# EAGLE design SparkFun_QwiicBus_Endpoint (EAGLE 9.6.0)
ABBREV: hb1; PROJECT: Heading Board
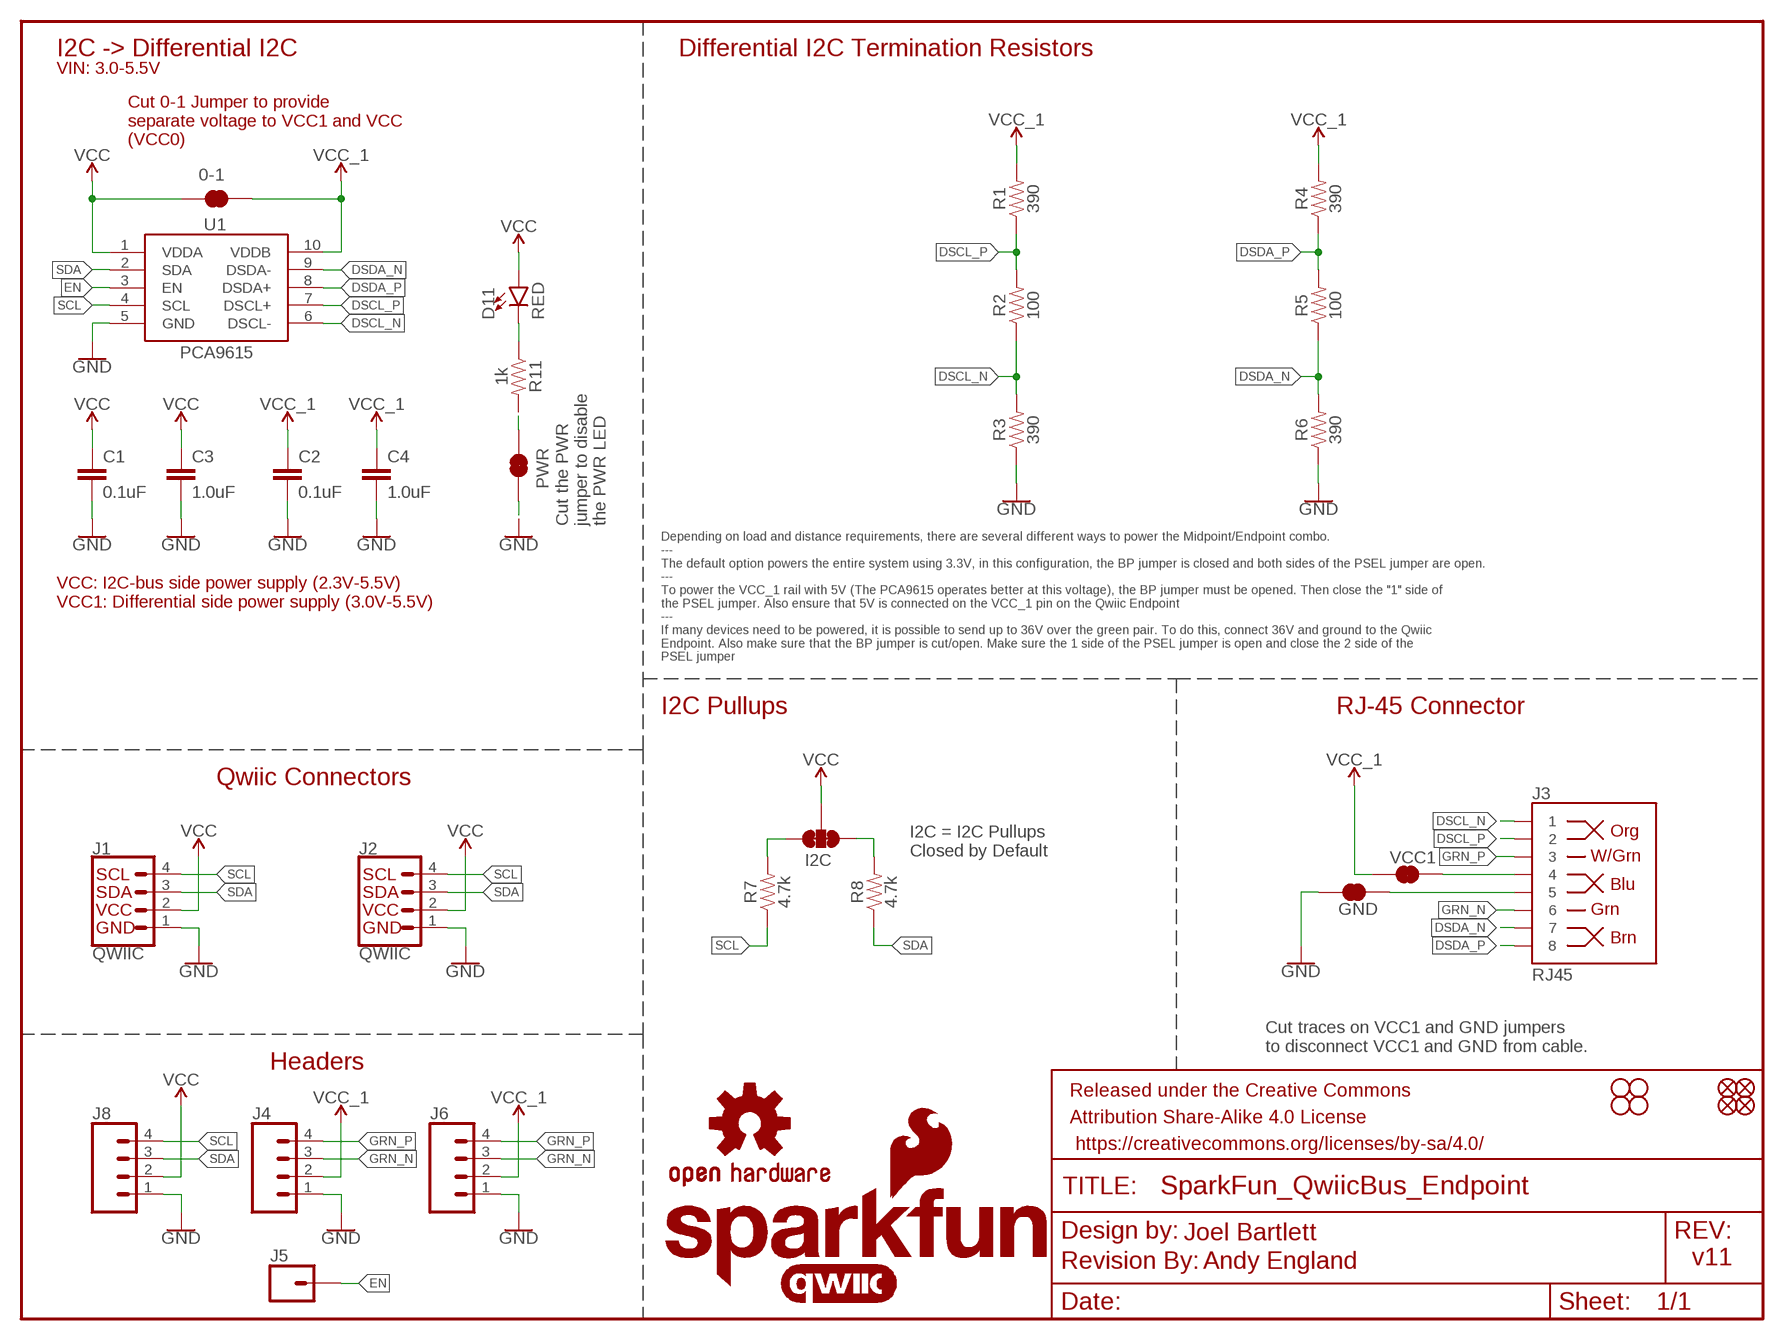
[diagram p0: schematic, sheet 1]

## Parts
0-1  JUMPER-SMT_2_NC_TRACE_SILK  [SMT-JUMPER_2_NC_TRACE_SILK]
C1  0.1uF  0.1UF-0603-25V-(+80/-20%)  [0603]
C2  0.1uF  0.1UF-0603-25V-(+80/-20%)  [0603]
C3  1.0uF  1.0UF-0603-16V-10%  [0603]
C4  1.0uF  1.0UF-0603-16V-10%  [0603]
D11  RED  LED-RED0603  [LED-0603]
FD1  FIDUCIALUFIDUCIAL  [FIDUCIAL-MICRO]
FD2  FIDUCIALUFIDUCIAL  [FIDUCIAL-MICRO]
FD3  FIDUCIALUFIDUCIAL  [FIDUCIAL-MICRO]
FD4  FIDUCIALUFIDUCIAL  [FIDUCIAL-MICRO]
FRAME1  FRAME-LETTER  [CREATIVE_COMMONS]
GND  JUMPER-SMT_2_NC_TRACE_SILK  [SMT-JUMPER_2_NC_TRACE_SILK]
H1  STAND-OFF  [STAND-OFF]
H2  STAND-OFF  [STAND-OFF]
H3  STAND-OFF  [STAND-OFF]
H4  STAND-OFF  [STAND-OFF]
I2C  JUMPER-SMT_3_2-NC_TRACE_SILK  [SMT-JUMPER_3_2-NC_TRACE_SILK]
J1  QWIIC  QWIIC_CONNECTORJS-1MM  [JST04_1MM_RA]
J2  QWIIC  QWIIC_CONNECTORJS-1MM  [JST04_1MM_RA]
J3  RJ45  RJ45-8  [RJ45-8]
J4  CONN_041X04_NO_SILK  [1X04_NO_SILK]
J5  CONN_01PTH_NO_SILK_YES_STOP  [1X01_NO_SILK]
J6  CONN_041X04_NO_SILK  [1X04_NO_SILK]
J8  CONN_041X04_NO_SILK  [1X04_NO_SILK]
LOGO1  OSHW-LOGOM  [OSHW-LOGO-M]
LOGO2  REVISION  [REVISION]
LOGO3  QWIIC_LOGO_4MM  [QWIIC_4MM]
LOGO4  SFE_LOGO_NAME_FLAME.1_INCH  [SFE_LOGO_NAME_FLAME_.1]
LOGO5  SFE_LOGO_FLAME.1_INCH  [SFE_LOGO_FLAME_.1]
PWR  JUMPER-SMT_2_NC_TRACE_SILK  [SMT-JUMPER_2_NC_TRACE_SILK]
R1  390  390OHM-0603-1/10W-1%  [0603]
R2  100  100OHM-0603-1/10W-1%  [0603]
R3  390  390OHM-0603-1/10W-1%  [0603]
R4  390  390OHM-0603-1/10W-1%  [0603]
R5  100  100OHM-0603-1/10W-1%  [0603]
R6  390  390OHM-0603-1/10W-1%  [0603]
R7  4.7k  4.7KOHM-0603-1/10W-1%  [0603]
R8  4.7k  4.7KOHM-0603-1/10W-1%  [0603]
R11  1k  1KOHM-0603-1/10W-1%  [0603]
U1  PCA9615  [TSSOP10]
VCC1  JUMPER-SMT_2_NC_TRACE_SILK  [SMT-JUMPER_2_NC_TRACE_SILK]

## Nets
DSCL_N: J3.1 R2.1 R3.2 U1.6(DSCL-)
DSCL_P: J3.2 R1.1 R2.2 U1.7(DSCL+)
DSDA_N: J3.7 R5.1 R6.2 U1.9(DSDA-)
DSDA_P: J3.8 R4.1 R5.2 U1.8(DSDA+)
EN: J5.1 U1.3(EN)
GND: C1.2 C2.2 C3.2 C4.2 GND.1 J1.1 J2.1 J4.1 J6.1 J8.1 PWR.1 R3.1 R6.1 U1.5(GND)
GRN_N: J3.6 J4.3 J6.3
GRN_P: J3.3 J4.4 J6.4
N$1: J3.4 VCC1.2
N$2: GND.2 J3.5
N$3: I2C.1 R8.2
N$4: I2C.3 R7.2
N$13: D11.C R11.1
N$14: PWR.2 R11.2
SCL: J1.4 J2.4 J8.4 R7.1 U1.4(SCL)
SDA: J1.3 J2.3 J8.3 R8.1 U1.2(SDA)
VCC: 0-1.2 C1.1 C3.1 D11.A I2C.2 J1.2 J2.2 J8.2 U1.1(VDDA)
VCC_1: 0-1.1 C2.1 C4.1 J4.2 J6.2 R1.2 R4.2 U1.10(VDDB) VCC1.1

## Notes on the sheet
- I2C -> Differential I2C | Differential I2C Termination Resistors
- VIN: 3.0-5.5V
- Cut 0-1 Jumper to provide
  separate voltage to VCC1 and VCC
  (VCC0)
- Cut the PWR 
  jumper to disable
  the PWR LED
- VCC: I2C-bus side power supply (2.3V-5.5V)
  VCC1: Differential side power supply (3.0V-5.5V)
- Depending on load and distance requirements, there are several different ways to power the Midpoint/Endpoint combo. 
  ---
  The default option powers the entire system using 3.3V, in this configuration, the BP jumper is closed and both sides of the PSEL jumper are open.
  ---
  To power the VCC_1 rail with 5V (The PCA9615 operates better at this voltage), the BP jumper must be opened. Then close the "1" side of 
  the PSEL jumper. Also ensure that 5V is connected on the VCC_1 pin on the Qwiic Endpoint
  ---
  If many devices need to be powered, it is possible to send up to 36V over the green pair. To do this, connect 36V and ground to the Qwiic 
  Endpoint. Also make sure that the BP jumper is cut/open. Make sure the 1 side of the PSEL jumper is open and close the 2 side of the
  PSEL jumper
- I2C Pullups | RJ-45 Connector
- Qwiic Connectors
- I2C = I2C Pullups
  Closed by Default
- Cut traces on VCC1 and GND jumpers 
  to disconnect VCC1 and GND from cable.
- Headers
- Joel Bartlett
- Andy England | v11

## Library data of the parts
0-1 GND PWR VCC1 = SparkFun-Jumpers:JUMPER-SMT_2_NC_TRACE: Normally closed trace jumper This jumper has a trace between two pads so it's normally closed (NC). Use a razor knife to open the connection. For best results follow the IPC guidelines for cutting traces: Cutout at least 0.063 mm (0.005 in). Remove all loose material to clean up the cut area. Seal the cut with an approved epoxy. Reapply solder to reclose the connection.
C1 C2 = SparkFun-Capacitors:0.1UF: 0.1µF ceramic capacitors A capacitor is a passive two-terminal electrical component used to store electrical energy temporarily in an electric field.; PROD_ID: CAP-00810
C3 C4 = SparkFun-Capacitors:1.0UF: 1µF ceramic capacitors A capacitor is a passive two-terminal electrical component used to store electrical energy temporarily in an electric field.; PROD_ID: CAP-00868
D11 = SparkFun-LED:LED-RED: Red SMD LED Used in manufacturing of most products at SparkFun Packages: 0603 - SMD 0603 package [Product Link] <http://docs.avagotech.com/docs/AV02-0551EN> 0603 SMART - SMD 0603 SMART package ( more efficient and expensive)[Product Link] <http://www.osram-os.com/Graphics/XPic2/00077099_0.pdf> 1206 - SMD1206 package [Product Link] <https://www.sparkfun.com/datasheets/DevTools/LilyPad/Q150OVS4.pdff> SparkFun Products: Pro Mini 328 -5V <https://www.sparkfun.com/products/821> RedBoard <https://www.sparkfun.com/products/12757> IOIO-OTG <https://www.sparkfun.com/products/13613>; PROD_ID: DIO-00819
FD1-FD4 = SparkFun-Aesthetics:FIDUCIAL: Fiducial Alignment Points Point-of-reference for pick-and-place machines and other optical instruments.
FRAME1 = SparkFun-Aesthetics:FRAME-LETTER: Schematic Frame - Letter Standard 8.5x11 US Letter frame
H1-H4 = SparkFun-Hardware:STAND-OFF: Stand Off Drill holes for mechanically mounting via screws, standoffs, etc. Note: Use the keepout ring to avoid running the screw head into surrounding components. Variant Overviews STAND-OFF - Mechanical footprint for a #4 phillips button head screw. STAND-OFF-TIGHT - Mechanical footprint for a #4 phillips button head screw, Example SparkFun Products Screw - Phillips Head (1/4", 4-40, 10 pack) <https://www.sparkfun.com/products/10453> (PRT-10453) Screw - Phillips Head (1/2", 4-40, 10 pack) <https://www.sparkfun.com/products/10452> (PRT-10452) Screw - Phillips Head (3/4", 4-40, 10 pack) <https://www.sparkfun.com/products/10451> (PRT-10451) Screw - Phillips Head (1", 4-40, 10 pack) <https://www.sparkfun.com/products/10450> (PRT-10450)
I2C = SparkFun-Jumpers:JUMPER-SMT_3_2-NC_TRACE: Normally closed trace jumper (2 of 2 connections) This jumper has a trace between all three pads so they are normally closed (NC). Use a razor knife to open the connection(s). For best results follow the IPC guidelines for cutting traces: Cutout at least 0.063 mm (0.005 in). Remove all loose material to clean up the cut area. Seal the cut with an approved epoxy. Reapply solder to reclose the connection(s).
J1 J2 = SparkFun-Connectors:QWIIC_CONNECTOR: SparkFun I2C Standard Qwiic Connector An SMD 1mm pitch JST connector makes it easy and quick (get it? Qwiic?) to connect I2C devices to each other. The Qwiic system <http://www.sparkfun.com/qwiic> enables fast and solderless connection between popular platforms and various sensors and actuators. We carry 200mm <https://www.sparkfun.com/products/14204>, 100mm <https://www.sparkfun.com/products/14205>, 50mm <https://www.sparkfun.com/products/14206>, and breadboard friendly <https://www.sparkfun.com/products/14207> Qwiic cables. We also offer 10 pcs strips <https://www.sparkfun.com/products/14323> the SMD connectors.; PROD_ID: CONN-13694; VALUE: QWIIC_RIGHT_ANGLE
J3 = SparkFun-Connectors:RJ45-8: RJ45 Jack - 8 pin Simple RJ45, 8-pin connection. Commonly used for Cat5, Cat5e, and Cat6 Ethernet cables. Here is the connector we sell at SparkFun: RJ45 8-Pin Connector <https://www.sparkfun.com/products/643> (PRT-00643) Datasheet <https://cdn.sparkfun.com/datasheets/Prototyping/04908.pdf> It is used on this SparkFun product: SparkFun RJ45 Breakout <https://www.sparkfun.com/products/716> (BOB-00716) Note, you may also be interested in the "MAGJACK" version of this. It is basically a RJ45 connector, but also has some status LEDs built into the connector housing. You can check that out in this library at the device named "MAGJACK.dev" and see these products online: RJ45 Ethernet MagJack-Compatible <https://www.sparkfun.com/products/8534> (PRT-08534) SparkFun RJ45 MagJack Breakout <https://www.sparkfun.com/products/13021> (BOB-13021); PROD_ID: CONN-08506; SF_ID: PRT-00643
J4 J6 J8 = SparkFun-Connectors:CONN_04: Multi connection point. Often used as Generic Header-pin footprint for 0.1 inch spaced/style header connections On any of the 0.1 inch spaced packages, you can populate with these: Break Away Headers - Straight <https://www.sparkfun.com/products/116> (PRT-00116) Break Away Male Headers - Right Angle <https://www.sparkfun.com/products/553> (PRT-00553) Female Headers <https://www.sparkfun.com/products/115> (PRT-00115) Break Away Headers - Machine Pin <https://www.sparkfun.com/products/117> (PRT-00117) Break Away Female Headers - Swiss Machine Pin <https://www.sparkfun.com/products/743> (PRT-00743) For SCREWTERMINALS and SPRING TERMINALS visit here: Screw Terimnals on SparkFun.com <https://www.sparkfun.com/search/results?term=Screw+Terminals> (5mm/3.5mm/2.54mm spacing) This device is also useful as a general connection point to wire up your design to another part of your project. Our various solder wires solder well into these plated through hole pads. Hook-Up Wire - Assortment (Stranded, 22 AWG) <https://www.sparkfun.com/products/11375> (PRT-11375) Hook-Up Wire - Assortment (Solid Core, 22 AWG) <https://www.sparkfun.com/products/11367> (PRT-11367) View the entire wire category on our website here <https://www.sparkfun.com/categories/141> Special notes: Molex polarized connector foot print use with SKU : PRT-08231 with associated crimp pins and housings. 1MM SMD Version SKU: PRT-10208; PROD_ID: CONN-09696
J5 = SparkFun-Connectors:CONN_01: Single connection point. Often used as Generic Header-pin footprint for 0.1 inch spaced/style header connections On any of the 0.1 inch spaced packages, you can populate with these: Break Away Headers - Straight <https://www.sparkfun.com/products/116> (PRT-00116) Break Away Male Headers - Right Angle <https://www.sparkfun.com/products/553> (PRT-00553) Female Headers <https://www.sparkfun.com/products/115> (PRT-00115) Break Away Headers - Machine Pin <https://www.sparkfun.com/products/117> (PRT-00117) Break Away Female Headers - Swiss Machine Pin <https://www.sparkfun.com/products/743> (PRT-00743) This device is also useful as a general connection point to wire up your design to another part of your project. Our various solder wires solder well into these plated through hole pads. Hook-Up Wire - Assortment (Stranded, 22 AWG) <https://www.sparkfun.com/products/11375> (PRT-11375) Hook-Up Wire - Assortment (Solid Core, 22 AWG) <https://www.sparkfun.com/products/11367> (PRT-11367) View the entire wire category on our website here <https://www.sparkfun.com/categories/141> Special notes: SMTSO-256-ET is a "flush mount" nut for a 4-40 screw. We mostly use this on specialty testbeds; it is a nice way to connect hardware to your PCB at an adjustable hieght. Also note, the SNAP packages are for using a snappable style connector. We sell a baggie of snaps and they are also used on two LilyPad designs: Snap Assortment - 30 pack (male and female) <https://www.sparkfun.com/products/11347> (DEV-11347) LilyPad Arduino SimpleSnap <https://www.sparkfun.com/products/10941> (DEV-10941) LilyPad SimpleSnap Protoboard <https://www.sparkfun.com/products/10940> (DEV-10940)
LOGO1 = SparkFun-Aesthetics:OSHW-LOGO: Open-Source Hardware (OSHW) Logo This logo indicates the piece of hardware it is found on incorporates a OSHW license and/or adheres to the definition of open source hardware found here: http://freedomdefined.org/OSHW
LOGO2 = SparkFun-Aesthetics:REVISION: "Revision By" Text Preceding text for revisor documentation. Includes schematic text on "symbols" layer, and board text on tDoc.
LOGO3 = SparkFun-Aesthetics:QWIIC_LOGO: Qwiic Logos for placement on schematic and PCB. The 5.5mm silk logo is best for placing next to Qwiic connector.
LOGO4 = SparkFun-Aesthetics:SFE_LOGO_NAME_FLAME: SparkFun Font Logo w/ Flame This is the SparkFun full logo. The logo on the schematic will always be the same size; the package variant is the height of the flame part of the logo. Default layer for the logo on the board is tSilk.
LOGO5 = SparkFun-Aesthetics:SFE_LOGO_FLAME: SparkFun Flame Logo This is the SparkFun flame logo. The logo on the schematic will always be the same size; the package variant is the height of the flame. Default layer for the logo on the board is tSilk.
R1 R3 R4 R6 = SparkFun-Resistors:390OHM: 390Ω resistor A resistor is a passive two-terminal electrical component that implements electrical resistance as a circuit element. Resistors act to reduce current flow, and, at the same time, act to lower voltage levels within circuits. - Wikipedia; PROD_ID: RES-07864
R2 R5 = SparkFun-Resistors:100OHM: 100Ω resistor A resistor is a passive two-terminal electrical component that implements electrical resistance as a circuit element. Resistors act to reduce current flow, and, at the same time, act to lower voltage levels within circuits. - Wikipedia; PROD_ID: RES-07863
R7 R8 = SparkFun-Resistors:4.7KOHM: 4.7kΩ resistor A resistor is a passive two-terminal electrical component that implements electrical resistance as a circuit element. Resistors act to reduce current flow, and, at the same time, act to lower voltage levels within circuits. - Wikipedia; PROD_ID: RES-07857
R11 = SparkFun-Resistors:1KOHM: 1kΩ resistor A resistor is a passive two-terminal electrical component that implements electrical resistance as a circuit element. Resistors act to reduce current flow, and, at the same time, act to lower voltage levels within circuits. - Wikipedia; PROD_ID: RES-07856
U1 = SparkFun-IC-Comms:PCA9615: Differential I2C Bus Buffer Datasheet <https://www.nxp.com/docs/en/data-sheet/PCA9615.pdf>; PROD_ID: IC-13899

## Net classes
0 default: width 0.203 mm
1 power: width 0.381 mm, clearance 0.254 mm

## Board
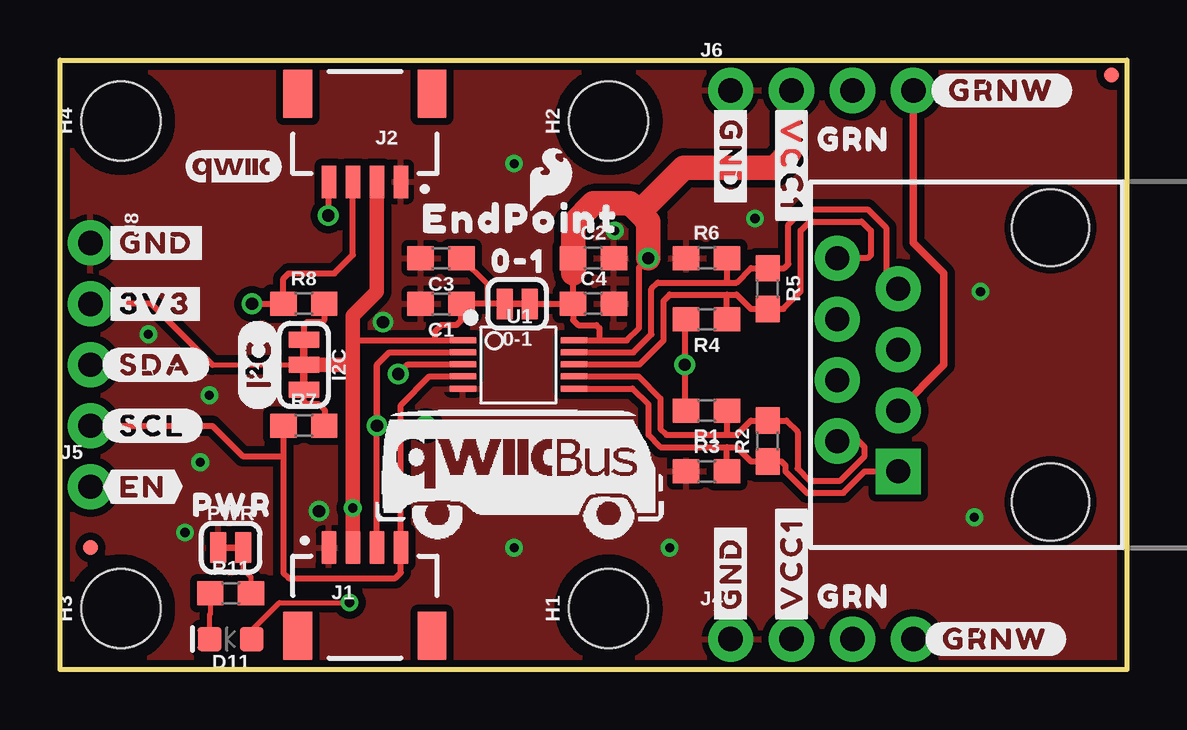
[diagram p1: board, top side]
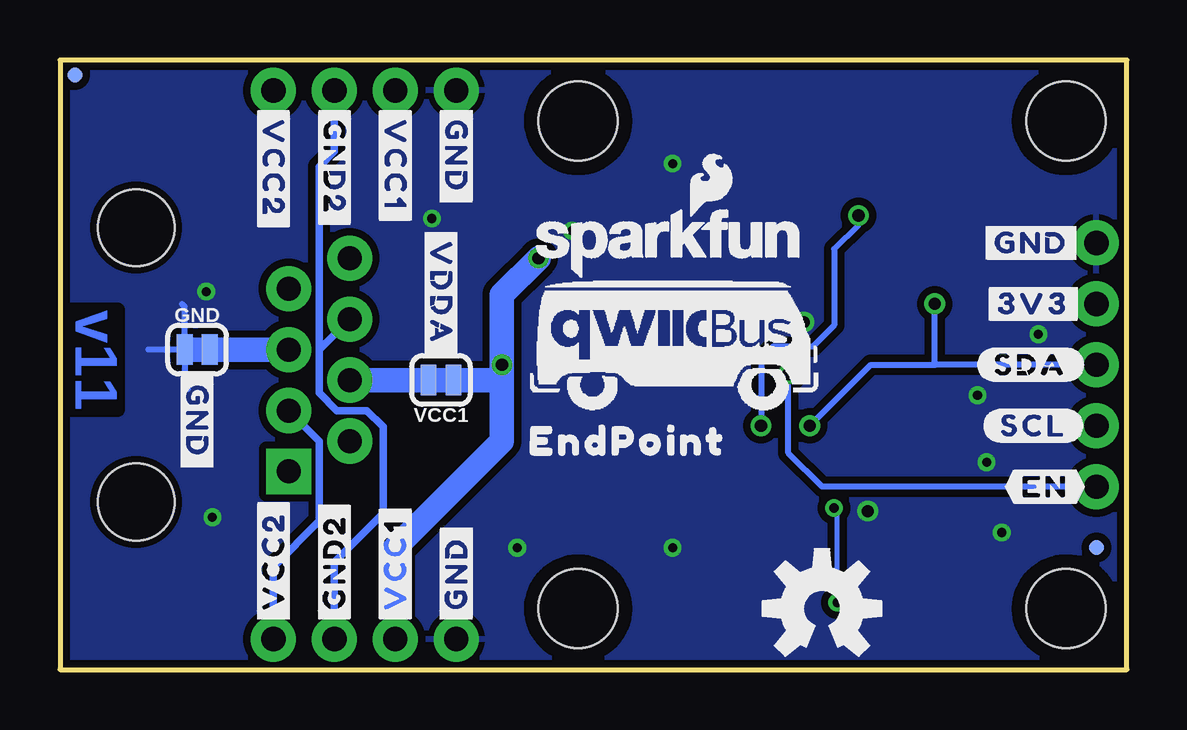
[diagram p2: board, bottom side, seen from below]

Size 44.45 x 25.4 mm. Coordinates in mm from the lower left corner, seen from the top.
Outline: 44.45,0 0,0 0,25.4 44.45,25.4 44.45,0
Copper layers (1*16): Top 0.035mm / dielectric 1.5mm / Bottom 0.035mm
Design rules "SparkFun-2-layer-TIGHT": minimum track width 7mil, minimum drill 15mil, track to track 7mil, track to pad 7mil, pad to pad 7mil, via to via 7mil, smd to smd 7mil, copper to edge 7mil, drill to drill 7mil, minimum pad ring 7mil, minimum via ring 7mil, stop-mask expansion 4mil, vias tented up to drill 25mil, thermal gap 10mil

### Footprints (pad centres in the part's own frame; a part is rotated, then mirrored left to right if it is on the bottom)
SMT-JUMPER_2_NC_TRACE_SILK = smd 0.66 x 1.27: 1 -0.521,0; 2 0.521,0
0603 = smd 1.1 x 1: 1 -0.85,0; 2 0.85,0
LED-0603 = smd 1 x 1: A -0.877,0; C 0.877,0
FIDUCIAL-MICRO = smd 0.635 x 0.635: 1 0,0
STAND-OFF = hole 3.302: 0,0
SMT-JUMPER_3_2-NC_TRACE_SILK = smd 0.66 x 1.27: 1 -1.041,0; 2 0,0; 3 1.041,0
JST04_1MM_RA = smd 0.6 x 1.35: 1 -1.5,0; 2 -0.5,0; 3 0.5,0; 4 1.5,0 | smd 1.2 x 2: NC1 2.8,-3.675; NC2 -2.8,-3.675
RJ45-8 = drill 1 pad 1.88 square: 1 -4.445,6.35 | drill 1 pad 1.88: 2 -3.175,8.89; 3 -1.905,6.35; 4 -0.635,8.89; 5 0.635,6.35; 6 1.905,8.89; 7 3.175,6.35; 8 4.445,8.89 | hole 3.2: -5.715,0; 5.715,0
1X04_NO_SILK = drill 1.016 pad 1.88: 1 0,0; 2 2.54,0; 3 5.08,0; 4 7.62,0
1X01_NO_SILK = drill 1.016 pad 1.88: 1 0,0
TSSOP10 = smd 1.1 x 0.25: 1 -2.259,1.018; 2 -2.259,0.517; 3 -2.259,0.018; 4 -2.259,-0.482; 5 -2.259,-0.988; 6 2.366,-0.988; 7 2.366,-0.482; 8 2.366,0.018; 9 2.366,0.517; 10 2.366,1.018

### Placement (x,y rotation side)
0-1  19.05,15.24 180 top
C1  15.88,15.24 180 top
C2  22.23,17.14 0 top
C3  15.88,17.14 180 top
C4  22.23,15.24 0 top
D11  7.11,1.27 180 top
FD1  1.27,5.08 0 top
FD2  43.81,24.77 0 top
FD3  1.27,5.08 0 bottom
FD4  43.81,24.77 0 bottom
FRAME1  -16.51,-8.89 0 top  (outside the outline)
GND  38.73,13.34 0 bottom
H1  22.86,2.54 90 top
H2  22.86,22.86 90 top
H3  2.54,2.54 90 top
H4  2.54,22.86 90 top
I2C  10.16,12.7 270 top
J1  12.7,5.08 0 top
J2  12.7,20.32 180 top
J3  41.27,12.7 90 top
J4  27.94,1.27 0 top
J5  1.27,7.62 0 top
J6  27.94,24.13 0 top
J8  1.27,17.78 270 top
LOGO1  12.7,2.54 0 bottom
LOGO2  -5.08,-11.43 0 top  (outside the outline)
LOGO3  7.24,20.95 0 top
LOGO4  19.05,17.78 0 bottom
LOGO5  20.45,20.45 0 top
PWR  7.11,5.08 0 top
R1  26.94,10.79 180 top
R2  29.48,9.53 90 top
R3  26.94,8.26 0 top
R4  26.94,14.61 180 top
R5  29.48,15.88 270 top
R6  26.94,17.14 0 top
R7  10.16,10.16 0 top
R8  10.16,15.24 0 top
R11  7.11,3.17 0 top
U1  19.05,12.7 0 top
U$1  [I2C]  8.26,10.79 90 top
U$2  [GRN0]  30.86,3.05 0 top
U$3  [#GND#0]  27.94,1.78 90 top
U$4  [#GND#0]  6.22,17.78 0 bottom
U$5  [#GND#0]  1.78,17.78 0 top
U$6  [#GND#0]  38.73,12.57 270 bottom
U$7  [#3V3#0]  1.78,15.24 0 top
U$8  [#3V3#0]  6.1,15.24 0 bottom
U$9  [#SDA#0]  1.78,12.7 0 top
U$10  [#SCL#0]  1.78,10.16 0 top
U$11  [#EN#0]  1.78,7.62 0 top
U$12  [#VDDA#0]  28.57,18.54 270 bottom
U$13  [#GND#0]  27.94,1.78 90 bottom
U$14  [#GND2#0]  33.02,23.62 270 bottom
U$15  [#SDA#0]  6.22,12.7 0 bottom
U$16  [#SCL#0]  5.97,10.16 0 bottom
U$17  [#EN#0]  5.08,7.62 0 bottom
U$18  [#GND2#0]  33.02,1.78 90 bottom
U$19  [#GRNW#0]  36.07,1.27 0 top
U$20  [#VCC1#0]  30.48,1.78 90 top
U$21  [#VCC1#0]  30.48,1.78 90 bottom
U$22  [#GRNW#0]  36.32,24.13 0 top
U$23  [QWIICBUS#WORKING#LOGO#JPG]  18.44,13.87 0 bottom
U$24  [#VCC2#0]  35.56,1.78 90 bottom
U$25  [0#10]  17.27,17.02 0 top
U$26  [ENDPOINT0]  25.78,9.53 0 bottom
U$27  [PWR0]  4.83,6.86 0 top
U$28  [QWIICBUS#WORKING#LOGO#JPG]  19.56,8.51 0 top
U$29  [GRN0]  30.86,22.1 0 top
U$30  [#VCC2#0]  35.56,23.62 270 bottom
U$31  [#VCC1#0]  30.48,23.62 270 bottom
U$32  [#VCC1#0]  30.48,23.62 270 top
U$33  [#GND#0]  27.94,23.62 270 bottom
U$34  [#GND#0]  27.94,23.62 270 top
U$35  [ENDPOINT0]  14.22,18.8 0 top
VCC1  28.57,12.06 180 bottom

### Tracks (layer width: path | path; a pad name or v marks a point on that pad's centre or on a via)
DSCL_N
  Top 0.254: U1.6 23.85,11.71 24.51,11.05 24.51,9.78 25.02,9.27 27.79,9.27 | R3.2 27.79,9.27 | J3.1 33.53,8.26 32.64,7.37 31.11,7.37 30.23,8.26 30.23,8.51 30.06,8.68 R2.1 28.79,8.68 28.19,9.27 27.79,9.27
DSCL_P
  Top 0.254: U1.7 24.11,12.22 25.02,11.3 25.02,10.03 25.27,9.78 27.79,9.78 | R1.1 27.79,9.78 | J3.2 33.27,9.53 33.53,9.27 33.53,8.89 32.51,7.87 31.24,7.87 30.73,8.38 30.73,9.91 30.27,10.38 R2.2 28.79,10.38 28.19,9.78 27.79,9.78
DSDA_N
  Top 0.254: U1.9 23.89,13.22 24.64,13.97 24.64,15.86 24.91,16.13 27.79,16.13 | R6.2 27.79,16.13 | J3.7 34.42,16.38 34.42,18.41 33.66,19.18 30.99,19.18 30.35,18.54 30.35,16.89 30.19,16.73 R5.1 28.79,16.73 28.19,16.13 27.79,16.13
DSDA_P
  Top 0.254: J3.8 33.66,17.14 33.78,17.27 33.78,18.29 33.4,18.67 31.24,18.67 30.86,18.29 30.86,15.75 30.14,15.03 R5.2 28.79,15.03 28.19,15.62 27.79,15.62 | U1.8 24.15,12.72 25.15,13.72 25.15,15.37 25.4,15.62 27.79,15.62 | R4.1 27.79,15.62
EN  (via drill 0.51)
  Top 0.254: U1.3 14.49,12.72 v14.1,12.32
  Bottom 0.254: J5.1 12.7,7.62 14.1,9.02 v14.1,12.32
GND  (via drill 0.38, 0.51)
  Bottom 0.254: GND.1 39.26,15.13 39.37,15.24 | GND.1 40.77,13.34 | GND.1 39.26,11.82 39.12,11.68
  other vias: 10.79,6.6 5.21,5.71 13.46,14.48 23.11,18.29 38.35,15.75 5.84,8.64 6.22,11.43 3.68,13.97 18.92,5.08 18.92,21.08 28.96,18.8 25.4,5.08 38.1,6.35
  pour Top (isolate 0.305): 44.45,0 0,0 0,25.4 44.45,25.4
  pour Bottom (isolate 0.305): 44.45,0 0,0 0,25.4 44.45,25.4
GRN_N
  Bottom 0.305: 33.66,13.34 33.66,11.54 32.91,10.79 31.67,10.79 30.99,10.12 30.99,6.51 33.02,4.48 J4.3 | J3.6 33.66,13.34 | 33.66,13.34 33.66,20.95 33.02,21.59 J6.3
GRN_P
  Top 0.305: J6.4 35.56,17.78 36.83,16.51 36.83,12.7 J3.3
  Bottom 0.305: J3.3 33.66,9.53 33.66,6.21 33.64,6.19 35.56,4.27 J4.4
N$1
  Bottom 1.016: J3.4 VCC1.2 28.07,12.06
N$2
  Bottom 1.016: J3.5 GND.2 39.12,13.34
N$3
  Top 0.254: R8.2 11.01,14.57 10.92,14.48 10.29,14.48 10.16,14.35 I2C.1
N$4
  Top 0.254: R7.2 11.05,10.2 11.05,10.79 10.79,11.05 10.29,11.05 10.16,11.18 I2C.3
N$13
  Top 0.203: R11.1 6.26,2.33 6.22,2.29 6.22,1.28 D11.C
N$14
  Top 0.203: R11.2 7.96,3.85 7.63,4.18 PWR.2
SCL  (via drill 0.51)
  Top 0.254: R7.1 9.31,8.89 | 9.31,8.89 9.31,4.03 9.53,3.81 13.97,3.81 14.2,4.04 J1.4 14.2,10.16 | 14.2,10.16 14.2,11.03 15.39,12.22 U1.4 | v15.24,10.16 14.2,10.16 | v11.18,18.92 11.2,18.95 J2.4 | J8.4 6.35,10.16 7.62,8.89 9.31,8.89
  Bottom 0.254: v15.24,10.16 15.24,12.95 14.73,13.46 13.08,13.46 12.19,14.35 12.19,17.53 11.18,18.54 v11.18,18.92
SDA  (via drill 0.51)
  Top 0.254: v8,15.24 R8.1 9.31,16.3 9.53,16.51 11.43,16.51 12.2,17.28 J2.3 | J1.3 13.2,12.69 13.21,12.7 | U1.2 13.73,13.22 13.21,12.7 | 13.21,12.7 v13.21,10.16
  Bottom 0.254: v13.21,10.16 10.67,12.7 8,12.7 | 8,12.7 v8,15.24 | J8.3 8,12.7
VCC  (via drill 0.38)
  Top 0.203: D11.A 7.99,1.64 9.14,2.79 v12.06,2.79 | C3.1 17.78,16.09 17.78,15.24 | 6.35,12.7 I2C.2
  Top 0.254: U1.1 15.62,13.72 | 6.35,12.7 3.81,15.24 J8.2 | 0-1.2 17.78,15.24 C1.1 16.73,14.57 16.64,14.48 16.51,14.35 15.88,14.35 15.62,14.1 15.62,13.72 | 12.2,13.97 12.45,13.72 15.62,13.72
  Top 0.61: J2.2 13.2,15.74 12.2,14.74 12.2,13.97 12.2,12.7 | 12.2,12.7 v12.2,6.73 J1.2 | I2C.2 12.2,12.7
  Bottom 0.203: v12.06,2.79 12.06,6.6 v12.2,6.73
VCC_1  (via drill 0.51)
  Top 0.254: 22.48,13.72 22.48,14.22 22.35,14.35 21.59,14.35 21.38,14.57 C4.1 | 22.48,13.72 23.62,13.72 24.13,14.22 24.13,16.76 v24.51,17.14 | 21.33,18.63 21.38,18.58 | 0-1.1 C4.1 | C4.1 21.38,16.51 C2.1 | R1.2 26.04,10.85 v26.04,12.7 26.04,14.55 R4.2 | U1.10 22.48,13.72
  Top 1.016: v24.51,17.14 24.51,18.67 24.13,19.05 | 24.13,19.05 23.75,19.43 22.23,19.43 21.38,18.58 21.38,16.51 | 24.13,19.05 26,20.92 29.77,20.92 30.39,21.53 30.39,24.04 J6.2
  Bottom 1.016: v24.51,17.14 26.04,15.62 v26.04,12.7 26.04,12.19 | J4.2 30.48,5.08 26.04,9.53 26.04,12.19 | 26.04,12.19 26.16,12.06 VCC1.1

### Text on the board
Bottom: v11
tDocu: Joel Bartlett | Andy England